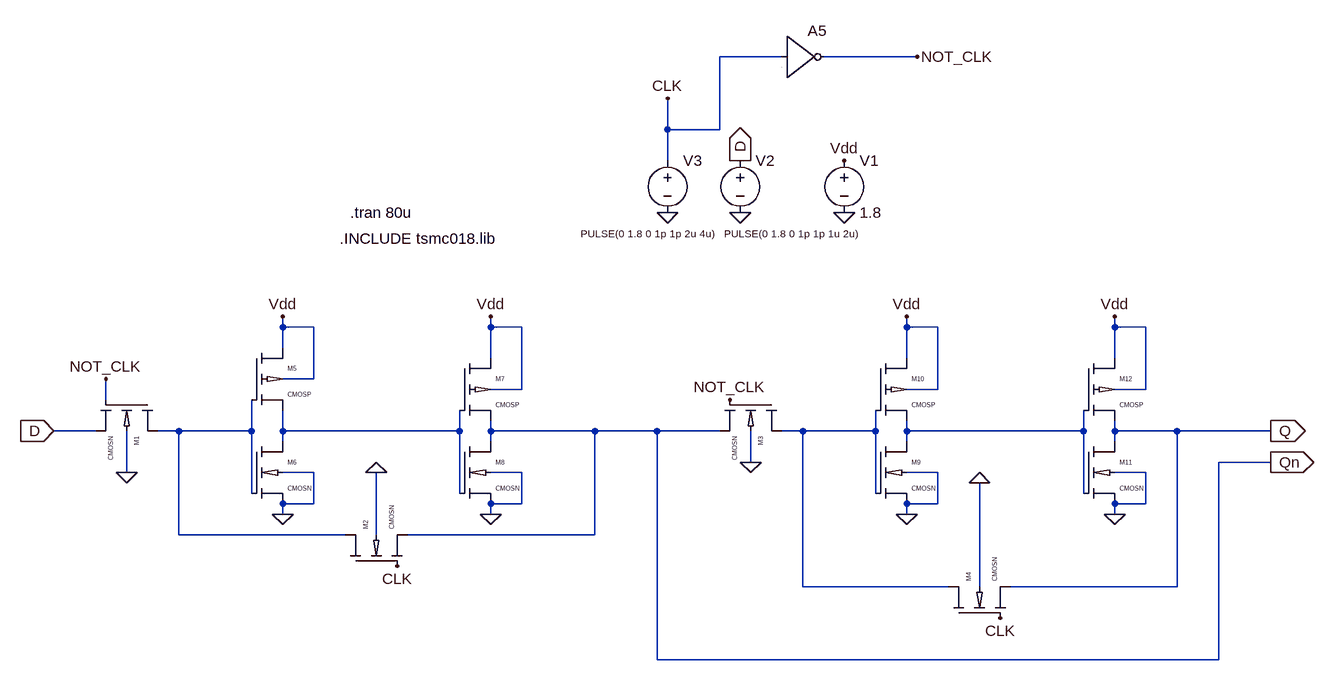
[diagram p0: schematic TASK3_DFF.asc]
TASK3_DFF.asc, the LTspice schematic file:
Version 4
SHEET 1 1036 680
WIRE 96 -432 0 -432
WIRE 304 -432 160 -432
WIRE -80 -320 -80 -368
WIRE 0 -320 0 -432
WIRE 0 -320 -80 -320
WIRE -80 -272 -80 -320
WIRE -672 -16 -672 -32
WIRE -624 -16 -672 -16
WIRE -352 -16 -352 -32
WIRE -304 -16 -352 -16
WIRE 288 -16 288 -32
WIRE 336 -16 288 -16
WIRE 608 -16 608 -32
WIRE 656 -16 608 -16
WIRE -672 16 -672 -16
WIRE -352 32 -352 -16
WIRE 288 32 288 -16
WIRE 608 32 608 -16
WIRE -624 64 -624 -16
WIRE -624 64 -672 64
WIRE -304 80 -304 -16
WIRE -304 80 -352 80
WIRE 336 80 336 -16
WIRE 336 80 288 80
WIRE 656 80 656 -16
WIRE 656 80 608 80
WIRE -944 96 -944 64
WIRE -960 144 -1024 144
WIRE -832 144 -864 144
WIRE -720 144 -720 96
WIRE -720 144 -832 144
WIRE -672 144 -672 112
WIRE -400 144 -400 112
WIRE -400 144 -672 144
WIRE -352 144 -352 128
WIRE -192 144 -352 144
WIRE -96 144 -192 144
WIRE 0 144 -96 144
WIRE 128 144 96 144
WIRE 240 144 240 112
WIRE 240 144 128 144
WIRE 288 144 288 128
WIRE 560 144 560 112
WIRE 560 144 288 144
WIRE 608 144 608 128
WIRE 704 144 608 144
WIRE 848 144 704 144
WIRE -672 160 -672 144
WIRE -352 160 -352 144
WIRE 288 160 288 144
WIRE 608 160 608 144
WIRE 48 192 48 144
WIRE 848 192 768 192
WIRE -912 208 -912 144
WIRE -624 208 -672 208
WIRE -304 208 -352 208
WIRE 336 208 288 208
WIRE 656 208 608 208
WIRE -720 240 -720 144
WIRE -400 240 -400 144
WIRE 240 240 240 144
WIRE 560 240 560 144
WIRE -624 256 -624 208
WIRE -624 256 -672 256
WIRE -304 256 -304 208
WIRE -304 256 -352 256
WIRE 336 256 336 208
WIRE 336 256 288 256
WIRE 656 256 656 208
WIRE 656 256 608 256
WIRE -672 272 -672 256
WIRE -352 272 -352 256
WIRE 288 272 288 256
WIRE 608 272 608 256
WIRE -832 304 -832 144
WIRE -576 304 -832 304
WIRE -528 304 -528 208
WIRE -192 304 -192 144
WIRE -192 304 -480 304
WIRE 128 384 128 144
WIRE 352 384 128 384
WIRE 400 384 400 224
WIRE 704 384 704 144
WIRE 704 384 448 384
WIRE -96 496 -96 144
WIRE 768 496 768 192
WIRE 768 496 -96 496
FLAG -912 208 0
FLAG -944 64 NOT_CLK
FLAG -1024 144 D
IOPIN -1024 144 In
FLAG -528 208 0
FLAG -496 352 CLK
FLAG 48 192 0
FLAG 16 96 NOT_CLK
FLAG 432 432 CLK
FLAG 32 -192 0
FLAG -80 -192 0
FLAG 32 -272 D
IOPIN 32 -272 Out
FLAG -80 -368 CLK
FLAG 304 -432 NOT_CLK
FLAG 400 224 0
FLAG -672 272 0
FLAG -352 272 0
FLAG -672 -32 Vdd
FLAG -352 -32 Vdd
FLAG 192 -272 Vdd
FLAG 192 -192 0
FLAG 288 272 0
FLAG 288 -32 Vdd
FLAG 608 272 0
FLAG 608 -32 Vdd
FLAG 848 144 Q
IOPIN 848 144 Out
FLAG 848 192 Qn
IOPIN 848 192 Out
SYMBOL Ncmos -864 96 R90
SYMATTR InstName M1
SYMBOL Ncmos -576 352 R270
SYMATTR InstName M2
SYMBOL Ncmos 96 96 R90
SYMATTR InstName M3
SYMBOL Ncmos 352 432 R270
SYMATTR InstName M4
SYMBOL voltage 32 -288 R0
WINDOW 3 -25 128 Left 1
WINDOW 123 0 0 Left 0
WINDOW 39 0 0 Left 0
SYMATTR Value PULSE(0 1.8 0 1p 1p 1u 2u)
SYMATTR InstName V2
SYMBOL voltage -80 -288 R0
WINDOW 3 69 128 Right 1
WINDOW 123 0 0 Left 0
WINDOW 39 0 0 Left 0
SYMATTR Value PULSE(0 1.8 0 1p 1p 2u 4u)
SYMATTR InstName V3
SYMBOL Digital\\inv 96 -496 R0
SYMATTR InstName A5
SYMBOL Pcmos -720 16 R0
SYMATTR InstName M5
SYMBOL Ncmos -720 160 R0
SYMATTR InstName M6
SYMBOL Ncmos -400 160 R0
SYMATTR InstName M8
SYMBOL Pcmos -400 32 R0
SYMATTR InstName M7
SYMBOL voltage 192 -288 R0
WINDOW 123 0 0 Left 0
WINDOW 39 0 0 Left 0
SYMATTR InstName V1
SYMATTR Value 1.8
SYMBOL Ncmos 240 160 R0
SYMATTR InstName M9
SYMBOL Pcmos 240 32 R0
SYMATTR InstName M10
SYMBOL Ncmos 560 160 R0
SYMATTR InstName M11
SYMBOL Pcmos 560 32 R0
SYMATTR InstName M12
TEXT -568 -192 Left 2 !.tran 80u
TEXT -584 -152 Left 2 !.INCLUDE tsmc018.lib

The netlist it stands for:
* TASK3_DFF.asc
M1 N001 NOT_CLK D 0 CMOSN
M2 N001 CLK Qn 0 CMOSN
M3 N003 NOT_CLK Qn 0 CMOSN
M4 N003 CLK Q 0 CMOSN
V2 D 0 PULSE(0 1.8 0 1p 1p 1u 2u)
V3 CLK 0 PULSE(0 1.8 0 1p 1p 2u 4u)
A5 CLK 0 0 0 0 NOT_CLK 0 0 BUF
M5 Vdd N001 N002 Vdd CMOSP
M6 N002 N001 0 0 CMOSN
M8 Qn N002 0 0 CMOSN
M7 Vdd N002 Qn Vdd CMOSP
V1 Vdd 0 1.8
M9 N004 N003 0 0 CMOSN
M10 Vdd N003 N004 Vdd CMOSP
M11 Q N004 0 0 CMOSN
M12 Vdd N004 Q Vdd CMOSP
.model NMOS NMOS
.model PMOS PMOS
.lib standard.mos
.tran 80u
.INCLUDE tsmc018.lib
.lib tsmc018.lib
.backanno
.end

* Results of the author's LTspice run, read from the files saved beside the schematic
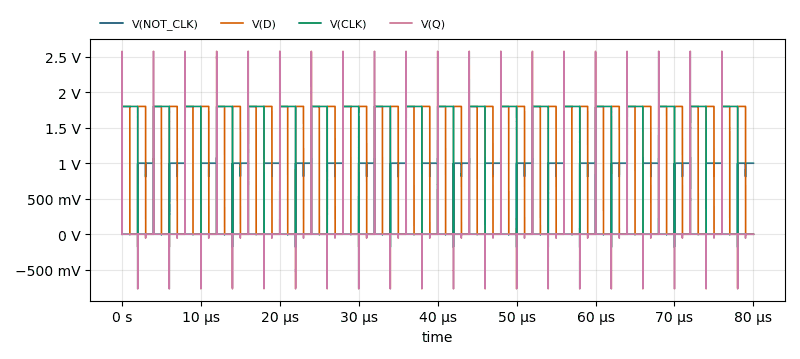
[diagram p1: Transient Analysis of TASK3_DFF.asc, plotted from the saved traces]
* Transient Analysis, 1 run:
*   V(NOT_CLK): min -181.9 mV, max 1.077 V, average 500 mV, rms 707.1 mV, last 1 V
*   V(D): min 0 V, max 1.8 V, average 900 mV, rms 1.273 V, last 0 V
*   V(CLK): min 0 V, max 1.8 V, average 900 mV, rms 1.273 V, last 0 V
*   V(Q): min -769.5 mV, max 2.578 V, average 156.3 µV, rms 8.21 mV, last 0 V